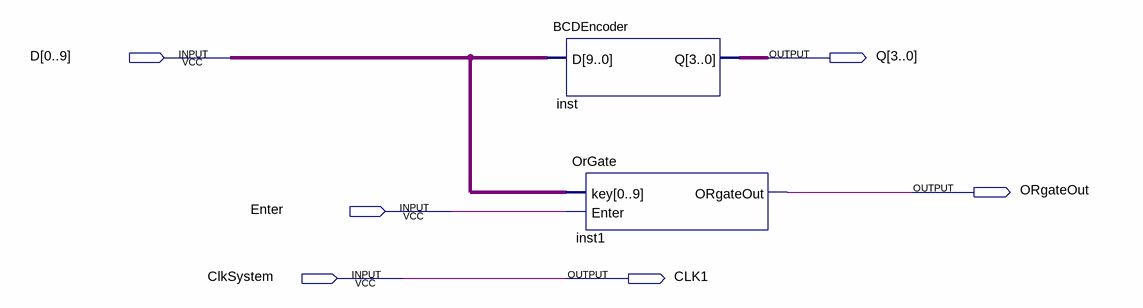
[diagram p0: schematic sheet]
// Quartus schematic Entrada.bdf as structural Verilog: 2 symbols, 6 pins
module Entrada (
  input  [0:9] D,
  input  Enter,
  input  ClkSystem,
  output [3:0] Q,
  output ORgateOut,
  output CLK1
);

  BCDEncoder inst (.D(D), .Q(Q));
  OrGate inst1 (.key(D), .Enter(Enter), .ORgateOut(ORgateOut));

  assign CLK1 = ClkSystem;
endmodule
